# Altium schematic sheet NX1117C33Z.SchDoc: LDO 3V3
size A4; MaxVOUTCurrent: 1000mA; MaxVIN: 20V; MinVIN: 0; TargetVOUT: 3V3; ActualVOUT: 3V234 to 3V366; PageSetup: Record=PageOptions|CenterHorizontal=True|CenterVertical=True|PrintScale=1.00|XCorrection=1.00|YCorrection=1.00|PrintKind=0|BorderSize=5000000|LeftOffset=0|BottomOffset=0|Orientation=2|PaperLength=1000|PaperWidth=1000|Scale=100|PaperSource=7|PrintQuality=-4|MediaType=1|DitherType=10|PaperKind=A4|PrintScaleMode=1; Class: Power; Subclass: Regulator
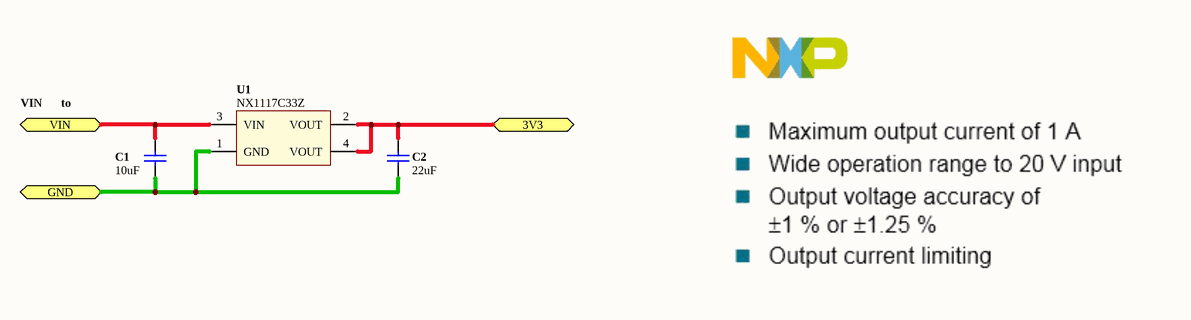
[diagram p0: NX1117C33Z.SchDoc]

## Parts
C1  value 10uF  [CAPC0805(2012)100_N]  (hidden comment: CAP 10uF 10V 0805(2012))
C2  value 22uF  [CAPC1206(3216)100_L]  (hidden comment: CAP 22uF 6.3V 1206(3216))
U1  NX1117C33Z  [NXP-SOT223]

## Ports
3V3, GND, VIN

## Nets
3V3: C2.2 U1.2(VOUT) U1.4(VOUT) ; port 3V3
GND: C1.1 C2.1 U1.1(GND) ; port GND
VIN: C1.2 U1.3(VIN) ; port VIN

## Notes on the sheet
- VIN
- to
- Sheet Title
- Project Title
- Size:
- Date:
- A4
- Item:
- Time:
- Revision:
- Sheet
- of
- File:

## Library data of the parts
C1 = CMP-1036-04925-1: CAP 10uF 10V ±20% 0805 (2012 Metric) Thickness 1mm SMD; Case-EIA: 0805; Case-Metric: 2012; Rated Voltage: 10 V; Max Thickness: 1 mm; Technology: SMT; Tolerance: ±20%
C2 = CMP-1037-04987-1: CAP 22uF 6.3V ±20% 1206 (3216 Metric) Thickness 1mm SMD; Case-EIA: 1206; Case-Metric: 3216; Rated Voltage: 6.3 V; Technology: SMT; Max Thickness: 1 mm; Tolerance: ±20%
U1 = CMP-5296-00001-1: Low-dropout linear regulator, 3.3V Output, SOT223; Class: Power Management; Max Input Voltage: 20V; Output Voltage Accuracy: 1 %; Output Voltage: 3V3; Price: 0.16; Datasheet: http://www.nxp.com/documents/data_sheet/NX1117C_NX1117CE_SER.pdf